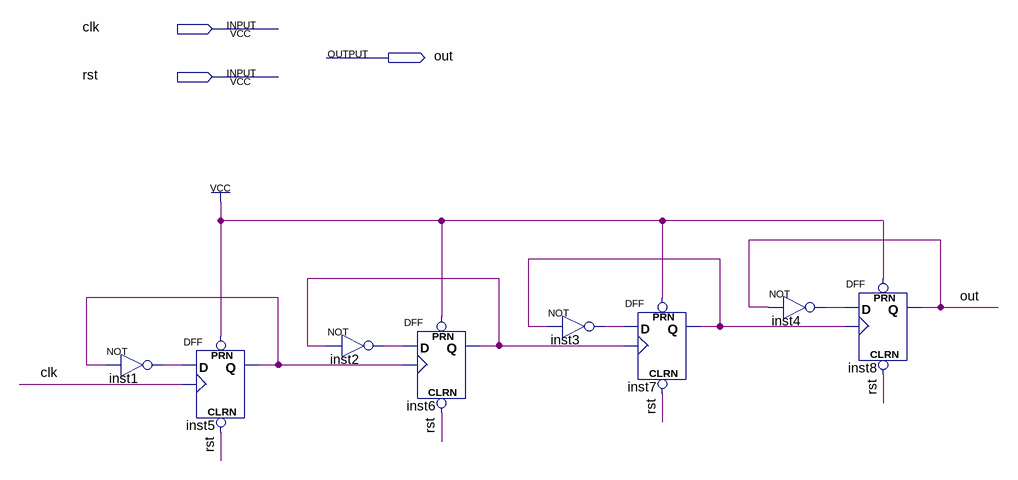
[diagram p0: schematic sheet]
// Quartus schematic 4ff.bdf as structural Verilog: 8 symbols, 3 pins
module \4ff  (
  input  clk,
  input  rst,
  output out
);

  wire inst1_out, inst2_out, inst3_out, inst4_out, inst5_q, inst6_q, inst7_q;

  not inst1 (inst1_out, inst5_q);
  DFF inst5 (.CLRN(rst), .CLK(clk), .D(inst1_out), .PRN(1'b1), .Q(inst5_q));
  not inst2 (inst2_out, inst6_q);
  DFF inst6 (.CLRN(rst), .CLK(inst5_q), .D(inst2_out), .PRN(1'b1), .Q(inst6_q));
  not inst3 (inst3_out, inst7_q);
  DFF inst7 (.CLRN(rst), .CLK(inst6_q), .D(inst3_out), .PRN(1'b1), .Q(inst7_q));
  not inst4 (inst4_out, out);
  DFF inst8 (.CLRN(rst), .CLK(inst7_q), .D(inst4_out), .PRN(1'b1), .Q(out));
endmodule
